# Altium schematic sheet 3_AT_START_F403A_V1.2_PowerPeripherals.SchDoc: Peripherals
size A4
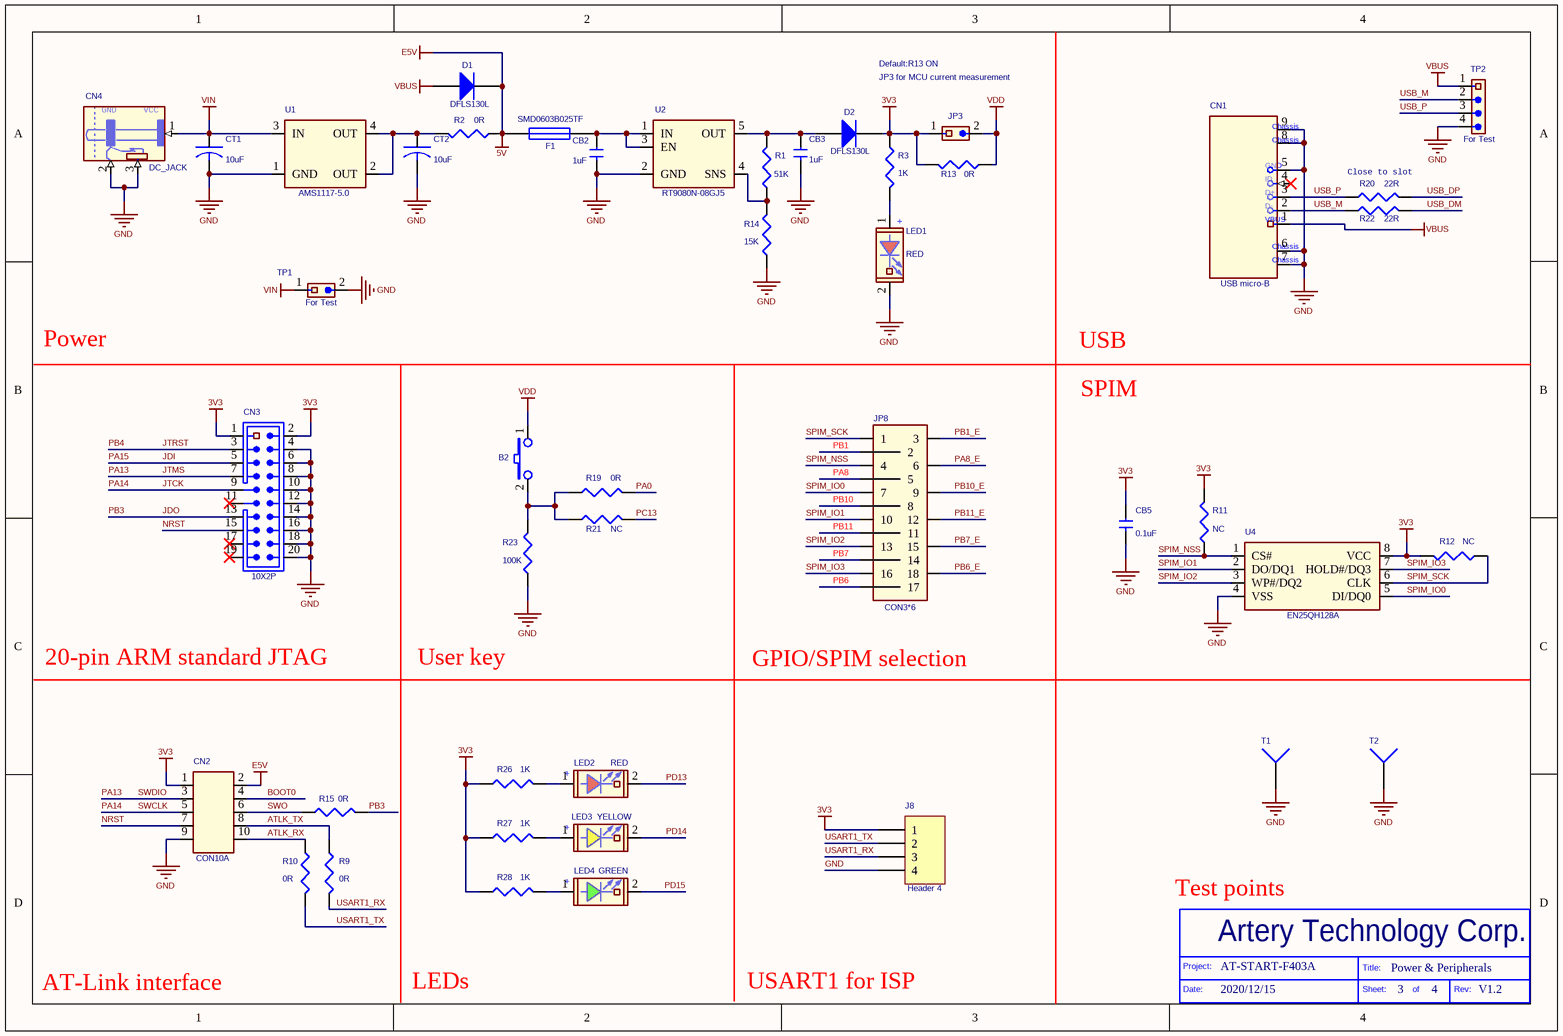
[diagram p0: 3_AT_START_F403A_V1.2_PowerPeripherals.SchDoc]

## Parts
B2  PB,Blue,SMD_2P  [KEY_SOP_6*6]  (value not drawn)
CB2  1uF  [C0603]
CB3  1uF  [C0603]
CB5  0.1uF  [C0603]
CN1  USB micro-B  [USB_MIC_DIP]
CN2  CON10A  [HDR2X5]
CN3  10X2P  [JTAG_20]
CN4  DC_JACK  [DC10B]
CT1  10uF  [C3528]
CT2  10uF  [C3528]
D1  DFLS130L  [SOD-123]
D2  DFLS130L  [SOD-123]
F1  SMD0603B025TF  [r0603]
J8  Header 4  [HDR1X4]
JP3  1X2P_2.54M  [HDR1X2]  (value not drawn)
JP8  CON3*6  [HDR3X6]
LED1  RED  [LED0603]
LED2  RED  [LED0603]
LED3  YELLOW  [LED0603]
LED4  GREEN  [LED0603]
R1  51K  [R0603]
R2  0R  [SB-PAD]
R3  1K  [R0603]
R9  0R  [SB-PAD]
R10  0R  [SB-PAD]
R11  NC  [R0603]
R12  NC  [R0603]
R13  0R  [SB-PAD]
R14  15K  [R0603]
R15  0R  [SB-PAD]
R19  0R  [SB-PAD]
R20  22R  [R0603]
R21  NC  [SB-PAD]
R22  22R  [R0603]
R23  100K  [R0603]
R26  1K  [R0603]
R27  1K  [R0603]
R28  1K  [R0603]
T1  Socket  [TestPoint]  (value not drawn)
T2  Socket  [TestPoint]  (value not drawn)
TP1  1X2P_2.54M  [HDR1X2 - SOP]  (value not drawn)
TP2  1X4P_2.54F  [HDR1X4 - top]  (value not drawn)
U1  AMS1117-5.0  [SOT223]
U2  RT9080N-08GJ5  [SOT-23-5]
U4  EN25QH128A  [SOIC8_208]

## Nets
3V3: CB5.1 CN2.1 CN3.1 CN3.2 D2.2(K) J8.1 JP3.1 R3.1 R11.2 R12.2 R13.2 R26.1 R27.1 R28.1 U4.8(VCC)
5V: CN2.2 D1.2(K) F1.1 R2.1  [also labelled E5V]
GND: CB2.2 CB3.2 CB5.2 CN1.5(GND) CN1.6 CN1.7 CN1.8 CN1.9 CN2.9 CN3.4 CN3.6 CN3.8 CN3.10 CN3.12 CN3.14 CN3.16 CN3.18 CN3.20 CN4.2 CN4.3 CT1.2 CT2.2 J8.4 LED1.2(CATHODE) R14.1 R23.1 T1.1 T2.1 TP1.2 TP2.4 U1.1(GND) U2.2(GND) U4.4(VSS)
VBUS: CN1.1(VBUS) D1.1(A) TP2.1
VDD: B2.1 JP3.2 R13.1
VIN: CN4.1 CT1.1 TP1.1 U1.3(IN)
ATLK_RX: CN2.10 R10.1
ATLK_TX: CN2.8 R9.1
BOOT0: CN2.4
JDI: CN3.5  [also labelled PA15]
JDO: CN3.13 R15.2  [also labelled PB3]
JTCK: CN2.5 CN3.9  [also labelled PA14, SWCLK]
JTMS: CN2.3 CN3.7  [also labelled PA13, SWDIO]
JTRST: CN3.3  [also labelled PB4]
NRST: CN2.7 CN3.15
PA0: R19.2
PA8: JP8.5
PA8_E: JP8.6
PB1: JP8.2
PB1_E: JP8.3
PB6: JP8.17
PB6_E: JP8.18
PB7: JP8.14
PB7_E: JP8.15
PB10: JP8.8
PB10_E: JP8.9
PB11: JP8.11
PB11_E: JP8.12
PC13: R21.2
PD13: LED2.2(CATHODE)
PD14: LED3.2(CATHODE)
PD15: LED4.2(CATHODE)
SPIM_IO0: JP8.7 U4.5(DI/DQ0)
SPIM_IO1: JP8.10 U4.2(DO/DQ1)
SPIM_IO2: JP8.13 U4.3(WP#/DQ2)
SPIM_IO3: JP8.16 U4.7(HOLD#/DQ3)
SPIM_NSS: JP8.4 R11.1 U4.1(CS#)
SPIM_SCK: JP8.1 R12.1 U4.6(CLK)
SWO: CN2.6 R15.1
USART1_RX: J8.3 R9.2
USART1_TX: J8.2 R10.2
USB_DM: R22.2
USB_DP: R20.2
USB_M: CN1.2(D-) R22.1 TP2.2
USB_P: CN1.3(D+) R20.1 TP2.3
NetB2_2: B2.2 R19.1 R21.1 R23.2
NetCB2_1: CB2.1 F1.2 U2.1(IN) U2.3(EN)
NetCB3_1: CB3.1 D2.1(A) R1.2 U2.5(OUT)
NetCT2_1: CT2.1 R2.2 U1.2(OUT) U1.4(OUT)
NetLED1_1: LED1.1(ANODE) R3.2
NetLED2_1: LED2.1(ANODE) R26.2
NetLED3_1: LED3.1(ANODE) R27.2
NetLED4_1: LED4.1(ANODE) R28.2
NetR1_1: R1.1 R14.2 U2.4(SNS)

Not connected (* = marked no-connect by the designer): CN1 4(ID)*; CN3 11* 17* 19*

## Notes on the sheet
- JP3 for MCU current measurement
- Default:R13 ON
- Close to slot
- (near TP2) For Test
- (near TP1) For Test
- Power
- USB
- SPIM
- 20-pin ARM standard JTAG
- User key
- GPIO/SPIM selection
- Test points
- LEDs
- USART1 for ISP
- AT-START-F403A
- Power & Peripherals
- AT-Link interface
- 2020/12/15
- 3
- 4
- V1.2
- Project:
- Date:
- Artery Technology Corp.
- Title:
- Sheet:
- of
- Rev:
- (in symbol DC12V_Power_JACK,2.0,DIP_3P) GND; VCC
- (in symbol GREEN,SMD0603) +
- (in symbol RED,SMD0603) +
- (in symbol USB_miniAB,SMD_0) Chassis
- (in symbol YELLOW,SMD0603) +

## Library data of the parts
B2 = Push_Bottom,Blue,SMD_2P
CB2 CB3 = 0.1uF,50V,20%,SMD0603
CB5 = 10uF,10V,10%,SMD0603
CN1 = USB_miniAB,SMD_0
CN2 = CON10A_0
CN3 = 10x2P,Male,Housing,DIP_2.54
CN4 = DC12V_Power_JACK,2.0,DIP_3P
CT1 CT2 = 10uF,16V,20%,B_Case_Dup1: 10uF,10%,25V
D1 D2 = Diode: Default Diode; Published: 8-Jun-2000; LatestRevisionDate: 17-Jul-2002; LatestRevisionNote: Re-released for DXP Platform.; PackageVersion: Sep-1996; PackageReference: SMC; Publisher: Altium Limited; PackageDescription: DO-214-AB/SMC; 2 C-Bend Leads; Body 7.9 x 5.9 mm, inc. leads (LxW); Code_JEDEC: DO-214-AB
F1 = Fuse 1: Fuse; Published: 8-Jun-2000; LatestRevisionDate: 17-Jul-2002; LatestRevisionNote: Re-released for DXP Platform.; PackageReference: PIN-W2/E2.8; Publisher: Altium Limited; PackageDescription: Thru-Hole; 2 Leads
J8 = Header 4: Header, 4-Pin; LatestRevisionDate: 17-Jul-2002; LatestRevisionNote: Re-released for DXP Platform.; Publisher: Altium Limited
JP3 TP1 = 1X2P,Male,DIP_2.54
LED1 LED2 = RED,SMD0603
LED3 = YELLOW,SMD0603
LED4 = GREEN,SMD0603
R1-R3 R9 R10 R13-R15 R19 R21 R26-R28 = 470,1/10W,1%,SMD0603
R11 R12 = 47K,1/10W,1%,SMD0603
R20 R22 = 22,1/10W,1%,SMD0603
R23 = 10K,1/10W,1%,SMD0603
TP2 = 1X4P,Female,DIP_2.54
U1 = AMS1117-3.3
U2 = RT9080N
U4 = W25Q128FVSIQ,SOIC8_1
T1 T2 = Socket: LatestRevisionDate: 17-Jul-2002; LatestRevisionNote: Re-released for DXP Platform.; Publisher: Altium Limited